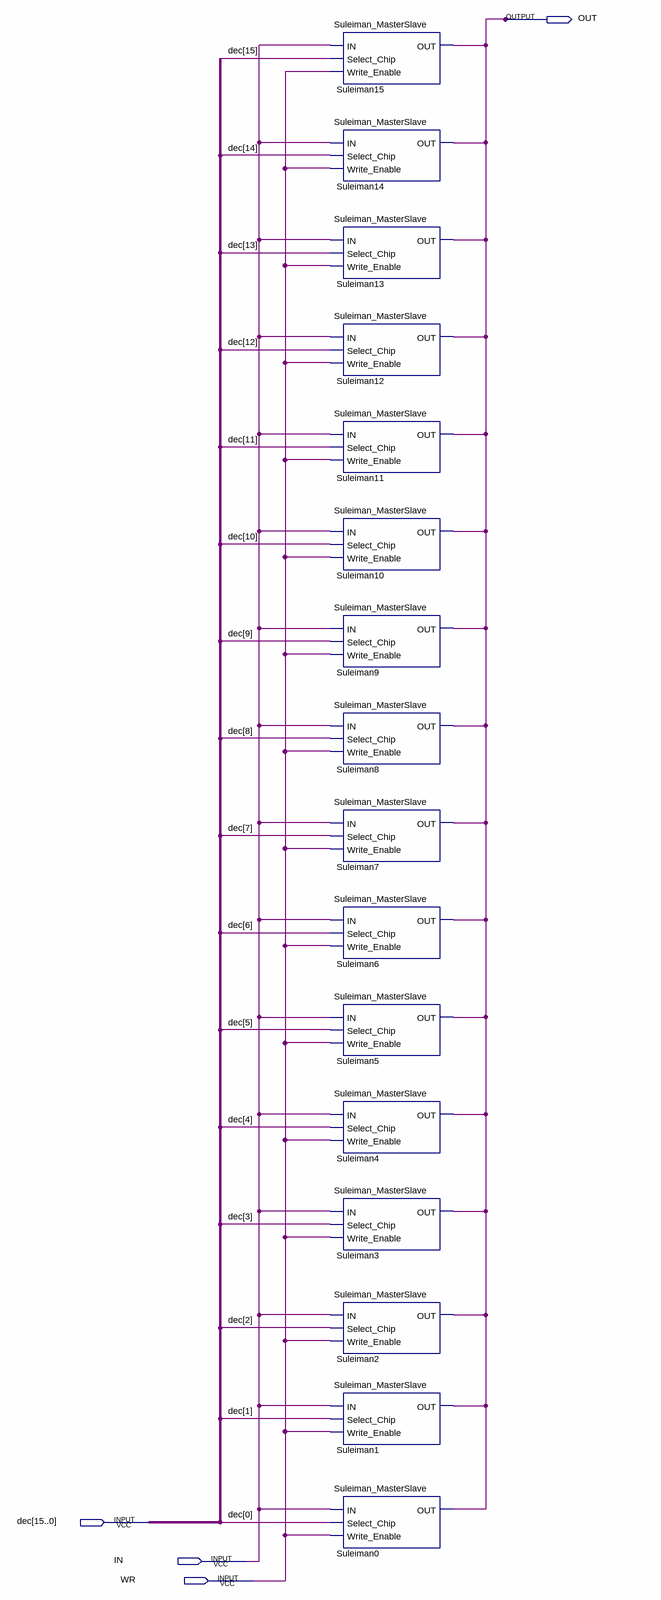
[diagram p0: schematic sheet]
// Quartus schematic Suleiman_16Address.bdf as structural Verilog: 16 symbols, 4 pins
module Suleiman_16Address (
  input  [15:0] dec,
  input  IN,
  input  WR,
  output OUT
);

  Suleiman_MasterSlave Suleiman15 (.IN(IN), .Select_Chip(dec[15]), .Write_Enable(WR), .OUT(OUT));
  Suleiman_MasterSlave Suleiman14 (.IN(IN), .Select_Chip(dec[14]), .Write_Enable(WR), .OUT(OUT));
  Suleiman_MasterSlave Suleiman13 (.IN(IN), .Select_Chip(dec[13]), .Write_Enable(WR), .OUT(OUT));
  Suleiman_MasterSlave Suleiman12 (.IN(IN), .Select_Chip(dec[12]), .Write_Enable(WR), .OUT(OUT));
  Suleiman_MasterSlave Suleiman11 (.IN(IN), .Select_Chip(dec[11]), .Write_Enable(WR), .OUT(OUT));
  Suleiman_MasterSlave Suleiman10 (.IN(IN), .Select_Chip(dec[10]), .Write_Enable(WR), .OUT(OUT));
  Suleiman_MasterSlave Suleiman9 (.IN(IN), .Select_Chip(dec[9]), .Write_Enable(WR), .OUT(OUT));
  Suleiman_MasterSlave Suleiman8 (.IN(IN), .Select_Chip(dec[8]), .Write_Enable(WR), .OUT(OUT));
  Suleiman_MasterSlave Suleiman7 (.IN(IN), .Select_Chip(dec[7]), .Write_Enable(WR), .OUT(OUT));
  Suleiman_MasterSlave Suleiman6 (.IN(IN), .Select_Chip(dec[6]), .Write_Enable(WR), .OUT(OUT));
  Suleiman_MasterSlave Suleiman5 (.IN(IN), .Select_Chip(dec[5]), .Write_Enable(WR), .OUT(OUT));
  Suleiman_MasterSlave Suleiman4 (.IN(IN), .Select_Chip(dec[4]), .Write_Enable(WR), .OUT(OUT));
  Suleiman_MasterSlave Suleiman3 (.IN(IN), .Select_Chip(dec[3]), .Write_Enable(WR), .OUT(OUT));
  Suleiman_MasterSlave Suleiman2 (.IN(IN), .Select_Chip(dec[2]), .Write_Enable(WR), .OUT(OUT));
  Suleiman_MasterSlave Suleiman1 (.IN(IN), .Select_Chip(dec[1]), .Write_Enable(WR), .OUT(OUT));
  Suleiman_MasterSlave Suleiman0 (.IN(IN), .Select_Chip(dec[0]), .Write_Enable(WR), .OUT(OUT));
endmodule
